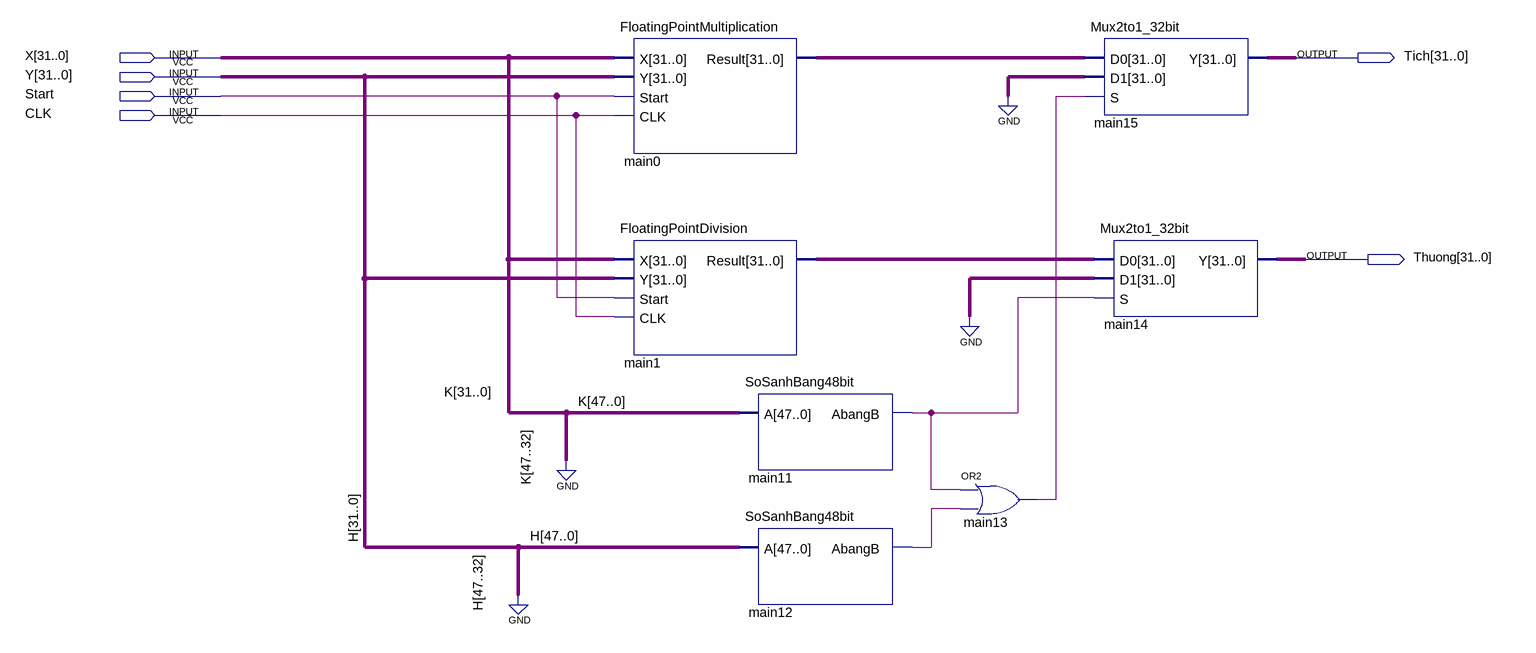
[diagram p0: schematic sheet]
// Quartus schematic Main.bdf as structural Verilog: 7 symbols, 6 pins
module Main (
  input  [31:0] X,
  input  [31:0] Y,
  input  Start,
  input  CLK,
  output [31:0] Tich,
  output [31:0] Thuong
);

  wire main11_abangb, main12_abangb, main13_out;
  wire [31:0] main0_result, main1_result;

  FloatingPointMultiplication main0 (.X(X), .Y(Y), .Start(Start), .CLK(CLK), .Result(main0_result));
  FloatingPointDivision main1 (.X(X), .Y(Y), .Start(Start), .CLK(CLK), .Result(main1_result));
  SoSanhBang48bit main11 (.A({{16{1'b0}}, X}), .AbangB(main11_abangb));
  SoSanhBang48bit main12 (.A({{16{1'b0}}, Y}), .AbangB(main12_abangb));
  or main13 (main13_out, main11_abangb, main12_abangb);
  Mux2to1_32bit main15 (.D0(main0_result), .D1({32{1'b0}}), .S(main13_out), .Y(Tich));
  Mux2to1_32bit main14 (.D0(main1_result), .D1({32{1'b0}}), .S(main11_abangb), .Y(Thuong));

  // Other names for the same wires on the sheet: K[31:0] = X; H[31:0] = Y
endmodule
